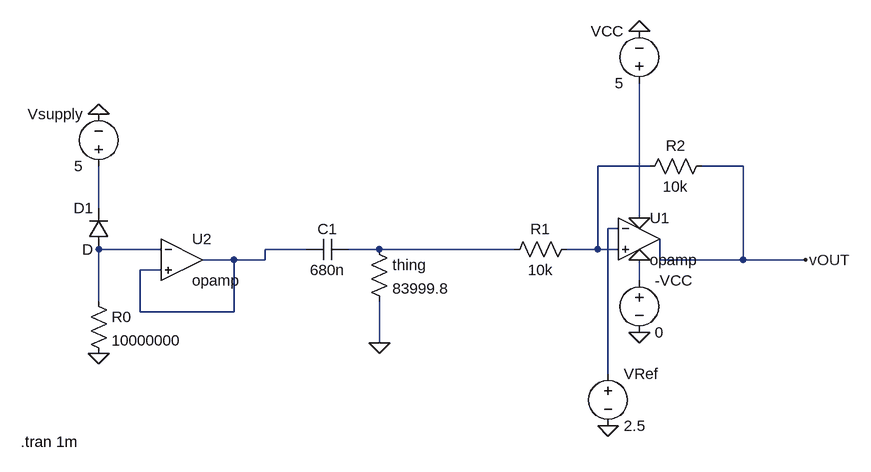
[diagram p0: schematic Sensor schematic.asc]
Sensor schematic.asc, the LTspice schematic file:
Version 4
SHEET 1 1136 680
WIRE 816 16 736 16
WIRE 960 16 896 16
WIRE -32 80 -32 16
WIRE 800 96 800 -112
WIRE 768 112 752 112
WIRE 64 144 -32 144
WIRE 288 144 224 144
WIRE 400 144 352 144
WIRE 608 144 400 144
WIRE 736 144 736 16
WIRE 736 144 688 144
WIRE 768 144 736 144
WIRE 176 160 128 160
WIRE 224 160 224 144
WIRE 224 160 176 160
WIRE 832 160 832 128
WIRE 960 160 960 16
WIRE 960 160 832 160
WIRE 1056 160 960 160
WIRE 64 176 32 176
WIRE 800 192 800 160
WIRE -32 224 -32 144
WIRE 32 240 32 176
WIRE 176 240 176 160
WIRE 176 240 32 240
WIRE 400 288 400 224
WIRE 752 336 752 112
FLAG -32 -64 0
FLAG 400 288 0
FLAG -32 304 0
FLAG 1056 160 vOUT
FLAG 752 416 0
FLAG 800 272 0
FLAG 800 -192 0
FLAG 800 96 0
FLAG 800 160 0
SYMBOL diode -16 144 R180
WINDOW 0 24 64 Left 2
WINDOW 3 24 0 Left 2
SYMATTR InstName D1
SYMBOL voltage -32 32 R180
WINDOW 0 24 96 Left 2
WINDOW 3 24 16 Left 2
WINDOW 123 0 0 Left 0
WINDOW 39 0 0 Left 0
SYMATTR InstName Vsupply
SYMATTR Value 5
SYMBOL cap 352 128 R90
WINDOW 0 0 32 VBottom 2
WINDOW 3 32 32 VTop 2
SYMATTR InstName C1
SYMATTR Value 680n
SYMBOL res 384 128 R0
SYMATTR InstName thing
SYMATTR Value 83999.8
SYMBOL res 704 128 R90
WINDOW 0 0 56 VBottom 2
WINDOW 3 32 56 VTop 2
SYMATTR InstName R1
SYMATTR Value 10k
SYMBOL res 912 0 R90
WINDOW 0 0 56 VBottom 2
WINDOW 3 32 56 VTop 2
SYMATTR InstName R2
SYMATTR Value 10k
SYMBOL res -48 208 R0
SYMATTR InstName R0
SYMATTR Value 10000000
SYMBOL voltage 752 320 R0
WINDOW 123 0 0 Left 0
WINDOW 39 0 0 Left 0
SYMATTR InstName VRef
SYMATTR Value 2.5
SYMBOL voltage 800 176 R0
WINDOW 123 0 0 Left 0
WINDOW 39 0 0 Left 0
SYMATTR InstName -VCC
SYMATTR Value 0
SYMBOL voltage 800 -96 R180
WINDOW 0 24 96 Left 2
WINDOW 3 24 16 Left 2
WINDOW 123 0 0 Left 0
WINDOW 39 0 0 Left 0
SYMATTR InstName VCC
SYMATTR Value 5
SYMBOL OpAmps\\opamp 800 64 R0
SYMATTR InstName U1
SYMBOL OpAmps\\opamp 96 96 R0
SYMATTR InstName U2
TEXT -152 440 Left 2 !.tran 1m

The netlist it stands for:
* Sensor schematic.asc
D1 N004 N002 D
Vsupply N002 0 5
C1 N006 N005 680n
R§thing N006 0 83999.8
R1 N001 N006 10k
R2 vOUT N001 10k
R0 N004 0 10000000
VRef N003 0 2.5
V§-VCC 0 0 0
VCC 0 0 5
XU1 N003 N001 vOUT opamp Aol=100K GBW=10Meg  ; pins invin noninvin out
XU2 N004 N005 N005 opamp Aol=100K GBW=10Meg  ; pins invin noninvin out
.model D D
.lib standard.dio
.tran 1m
.backanno
.end